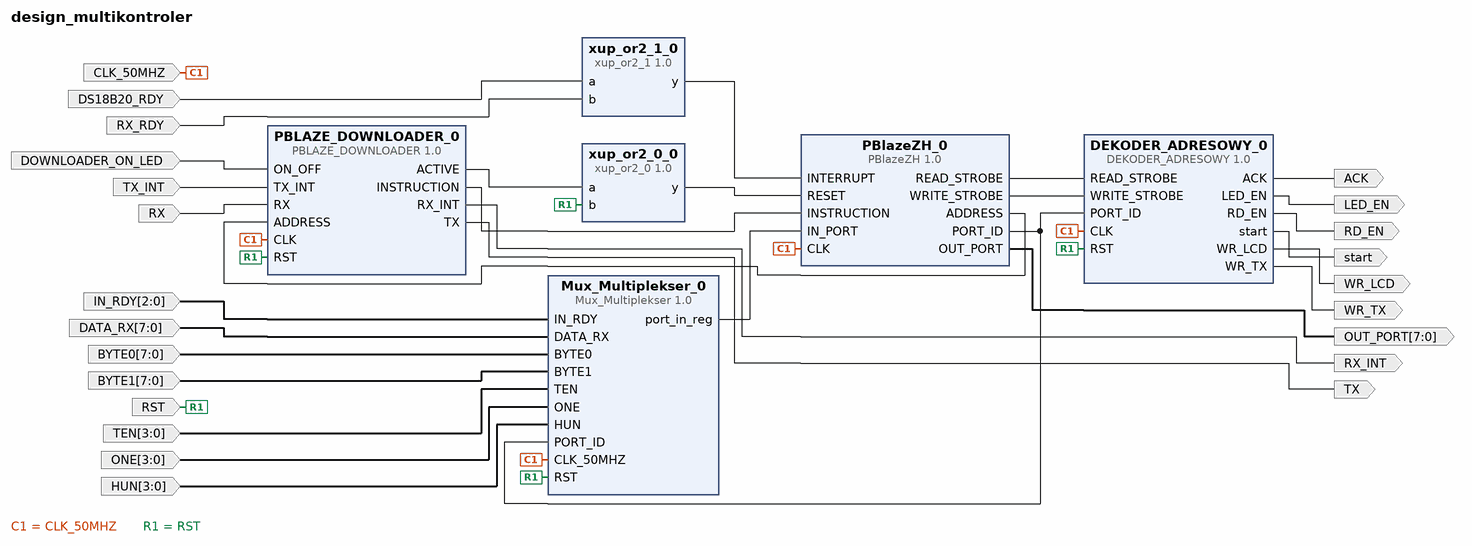
[diagram p0: block diagram of the top level]
# Vivado block design design_multikontroler, xc7z020clg400-2, Vivado 2019.1
create_bd_design design_multikontroler

create_bd_port -dir I -from 2 -to 0 IN_RDY
create_bd_port -dir I -from 7 -to 0 DATA_RX
create_bd_port -dir I -from 7 -to 0 BYTE0
create_bd_port -dir I -from 7 -to 0 BYTE1
create_bd_port -dir I -from 3 -to 0 TEN
create_bd_port -dir I -from 3 -to 0 ONE
create_bd_port -dir I -from 3 -to 0 HUN
create_bd_port -dir I CLK_50MHZ
create_bd_port -dir I -type rst RST
create_bd_port -dir I DS18B20_RDY
create_bd_port -dir I RX_RDY
create_bd_port -dir O RX_INT
create_bd_port -dir O TX
create_bd_port -dir O -from 7 -to 0 OUT_PORT
create_bd_port -dir I DOWNLOADER_ON_LED
create_bd_port -dir O WR_LCD
create_bd_port -dir O WR_TX
create_bd_port -dir O RD_EN
create_bd_port -dir O LED_EN
create_bd_port -dir O ACK
create_bd_port -dir O start
create_bd_port -dir I TX_INT
create_bd_port -dir I RX

create_bd_cell -type ip -vlnv xilinx.com:user:PBLAZE_DOWNLOADER:1.0 PBLAZE_DOWNLOADER_0
create_bd_cell -type ip -vlnv xilinx.com:user:PBlazeZH:1.0 PBlazeZH_0
create_bd_cell -type ip -vlnv xilinx.com:user:Mux_Multiplekser:1.0 Mux_Multiplekser_0
create_bd_cell -type ip -vlnv xilinx.com:user:DEKODER_ADRESOWY:1.0 DEKODER_ADRESOWY_0
create_bd_cell -type ip -vlnv xilinx.com:user:xup_or2_0:1.0 xup_or2_0_0
create_bd_cell -type ip -vlnv xilinx.com:user:xup_or2_1:1.0 xup_or2_1_0

# ---- connections ----

connect_bd_net -net IN_RDY_0_1 [get_bd_ports IN_RDY] [get_bd_pins Mux_Multiplekser_0/IN_RDY]
connect_bd_net -net DATA_RX_0_1 [get_bd_ports DATA_RX] [get_bd_pins Mux_Multiplekser_0/DATA_RX]
connect_bd_net -net BYTE0_0_1 [get_bd_ports BYTE0] [get_bd_pins Mux_Multiplekser_0/BYTE0]
connect_bd_net -net BYTE1_0_1 [get_bd_ports BYTE1] [get_bd_pins Mux_Multiplekser_0/BYTE1]
connect_bd_net -net TEN_0_1 [get_bd_ports TEN] [get_bd_pins Mux_Multiplekser_0/TEN]
connect_bd_net -net ONE_0_1 [get_bd_ports ONE] [get_bd_pins Mux_Multiplekser_0/ONE]
connect_bd_net -net HUN_0_1 [get_bd_ports HUN] [get_bd_pins Mux_Multiplekser_0/HUN]
connect_bd_net -net CLK_50MHZ_0_1 [get_bd_ports CLK_50MHZ] \
  [get_bd_pins Mux_Multiplekser_0/CLK_50MHZ] [get_bd_pins DEKODER_ADRESOWY_0/CLK] [get_bd_pins PBlazeZH_0/CLK] \
  [get_bd_pins PBLAZE_DOWNLOADER_0/CLK]
connect_bd_net -net RST_0_1 [get_bd_ports RST] \
  [get_bd_pins Mux_Multiplekser_0/RST] [get_bd_pins DEKODER_ADRESOWY_0/RST] [get_bd_pins PBLAZE_DOWNLOADER_0/RST] \
  [get_bd_pins xup_or2_0_0/b]
connect_bd_net -net a_0_1 [get_bd_ports DS18B20_RDY] [get_bd_pins xup_or2_1_0/a]
connect_bd_net -net b_0_1 [get_bd_ports RX_RDY] [get_bd_pins xup_or2_1_0/b]
connect_bd_net [get_bd_pins PBLAZE_DOWNLOADER_0/RX_INT] [get_bd_ports RX_INT]
connect_bd_net [get_bd_pins PBLAZE_DOWNLOADER_0/TX] [get_bd_ports TX]
connect_bd_net [get_bd_pins PBlazeZH_0/OUT_PORT] [get_bd_ports OUT_PORT]
connect_bd_net -net ON_OFF_0_1 [get_bd_ports DOWNLOADER_ON_LED] [get_bd_pins PBLAZE_DOWNLOADER_0/ON_OFF]
connect_bd_net [get_bd_pins DEKODER_ADRESOWY_0/WR_LCD] [get_bd_ports WR_LCD]
connect_bd_net [get_bd_pins DEKODER_ADRESOWY_0/WR_TX] [get_bd_ports WR_TX]
connect_bd_net [get_bd_pins DEKODER_ADRESOWY_0/RD_EN] [get_bd_ports RD_EN]
connect_bd_net [get_bd_pins DEKODER_ADRESOWY_0/LED_EN] [get_bd_ports LED_EN]
connect_bd_net [get_bd_pins DEKODER_ADRESOWY_0/ACK] [get_bd_ports ACK]
connect_bd_net [get_bd_pins DEKODER_ADRESOWY_0/start] [get_bd_ports start]
connect_bd_net [get_bd_pins Mux_Multiplekser_0/port_in_reg] [get_bd_pins PBlazeZH_0/IN_PORT]
connect_bd_net [get_bd_pins PBlazeZH_0/PORT_ID] [get_bd_pins DEKODER_ADRESOWY_0/PORT_ID] [get_bd_pins Mux_Multiplekser_0/PORT_ID]
connect_bd_net [get_bd_pins PBlazeZH_0/READ_STROBE] [get_bd_pins DEKODER_ADRESOWY_0/READ_STROBE]
connect_bd_net [get_bd_pins PBlazeZH_0/WRITE_STROBE] [get_bd_pins DEKODER_ADRESOWY_0/WRITE_STROBE]
connect_bd_net [get_bd_pins xup_or2_0_0/y] [get_bd_pins PBlazeZH_0/RESET]
connect_bd_net [get_bd_pins xup_or2_1_0/y] [get_bd_pins PBlazeZH_0/INTERRUPT]
connect_bd_net [get_bd_pins PBLAZE_DOWNLOADER_0/INSTRUCTION] [get_bd_pins PBlazeZH_0/INSTRUCTION]
connect_bd_net [get_bd_pins PBlazeZH_0/ADDRESS] [get_bd_pins PBLAZE_DOWNLOADER_0/ADDRESS]
connect_bd_net -net TX_INT_0_1 [get_bd_ports TX_INT] [get_bd_pins PBLAZE_DOWNLOADER_0/TX_INT]
connect_bd_net [get_bd_pins PBLAZE_DOWNLOADER_0/ACTIVE] [get_bd_pins xup_or2_0_0/a]
connect_bd_net -net RX_0_1 [get_bd_ports RX] [get_bd_pins PBLAZE_DOWNLOADER_0/RX]

validate_bd_design
save_bd_design
